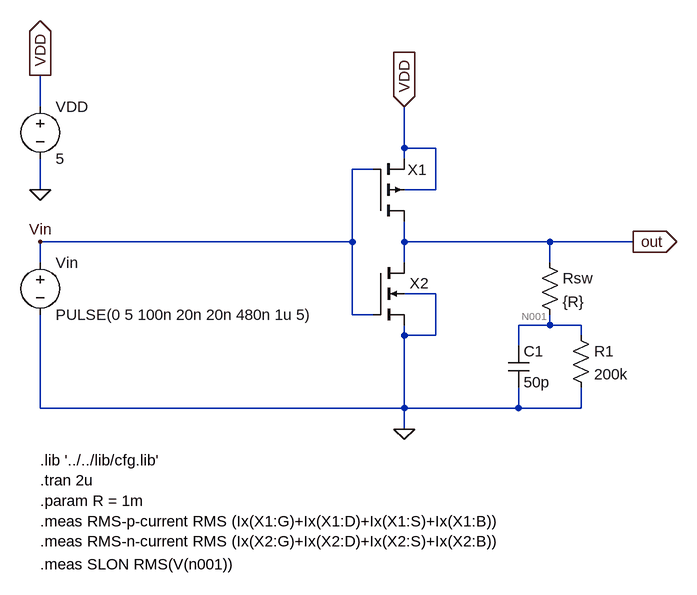
[diagram p0: schematic not[pulse].asc]
not[pulse].asc, the LTspice schematic file:
Version 4
SHEET 1 1232 752
WIRE -384 -64 -384 -112
WIRE 176 0 176 -64
WIRE 224 0 176 0
WIRE 176 16 176 0
WIRE 128 32 96 32
WIRE -384 64 -384 16
WIRE 224 64 224 0
WIRE 224 64 176 64
WIRE 96 144 96 32
WIRE 96 144 -384 144
WIRE 176 144 176 112
WIRE 400 144 176 144
WIRE 528 144 400 144
WIRE -384 176 -384 144
WIRE 176 176 176 144
WIRE 400 176 400 144
WIRE 224 224 176 224
WIRE 96 256 96 144
WIRE 128 256 96 256
WIRE 400 272 400 256
WIRE 400 272 352 272
WIRE 448 272 400 272
WIRE 176 288 176 272
WIRE 224 288 224 224
WIRE 224 288 176 288
WIRE 448 288 448 272
WIRE 352 304 352 272
WIRE -384 400 -384 256
WIRE 176 400 176 288
WIRE 176 400 -384 400
WIRE 352 400 352 368
WIRE 352 400 176 400
WIRE 448 400 448 368
WIRE 448 400 352 400
WIRE 176 432 176 400
FLAG -384 64 0
FLAG 528 144 out
IOPIN 528 144 Out
FLAG -384 -112 VDD
IOPIN -384 -112 Out
FLAG -384 144 Vin
FLAG 176 432 0
FLAG 176 -64 VDD
IOPIN 176 -64 In
SYMBOL voltage -384 -80 R0
WINDOW 123 0 0 Left 2
WINDOW 39 24 124 Left 2
SYMATTR InstName VDD
SYMATTR Value 5
SYMBOL voltage -384 160 R0
WINDOW 123 0 0 Left 2
WINDOW 39 0 0 Left 2
SYMATTR InstName Vin
SYMATTR Value PULSE(0 5 100n 20n 20n 480n 1u 5)
SYMBOL cap 336 304 R0
SYMATTR InstName C1
SYMATTR Value 50p
SYMBOL res 432 272 R0
SYMATTR InstName R1
SYMATTR Value 200k
SYMBOL res 384 160 R0
SYMATTR InstName Rsw
SYMATTR Value {R}
SYMBOL pmos4 128 112 M180
WINDOW 0 53 79 Left 2
WINDOW 3 52 23 Invisible 2
SYMATTR InstName X1
SYMATTR Value pmos_t1
SYMATTR Prefix X
SYMBOL nmos4 128 176 R0
WINDOW 3 56 72 Invisible 2
SYMATTR InstName X2
SYMATTR Value nmos_t1
SYMATTR Prefix X
TEXT -384 480 Left 2 !.lib '../../lib/cfg.lib'\n.tran 2u\n.param R = 1m\n.meas RMS-p-current RMS (Ix(X1:G)+Ix(X1:D)+Ix(X1:S)+Ix(X1:B))\n.meas RMS-n-current RMS (Ix(X2:G)+Ix(X2:D)+Ix(X2:S)+Ix(X2:B))
TEXT -384 640 Left 2 !.meas SLON RMS(V(n001))

The netlist it stands for:
* not[pulse].asc
VDD VDD 0 5
Vin Vin 0 PULSE(0 5 100n 20n 20n 480n 1u 5)
C1 N001 0 50p
R1 N001 0 200k
Rsw out N001 {R}
XX1 out Vin VDD VDD pmos_t1  ; pins D G S B
XX2 out Vin 0 0 nmos_t1  ; pins D G S B
.lib '../../lib/cfg.lib'
.tran 2u
.param R = 1m
.meas RMS-p-current RMS (Ix(X1:G)+Ix(X1:D)+Ix(X1:S)+Ix(X1:B))
.meas RMS-n-current RMS (Ix(X2:G)+Ix(X2:D)+Ix(X2:S)+Ix(X2:B))
.meas SLON RMS(V(n001))
.backanno
.end